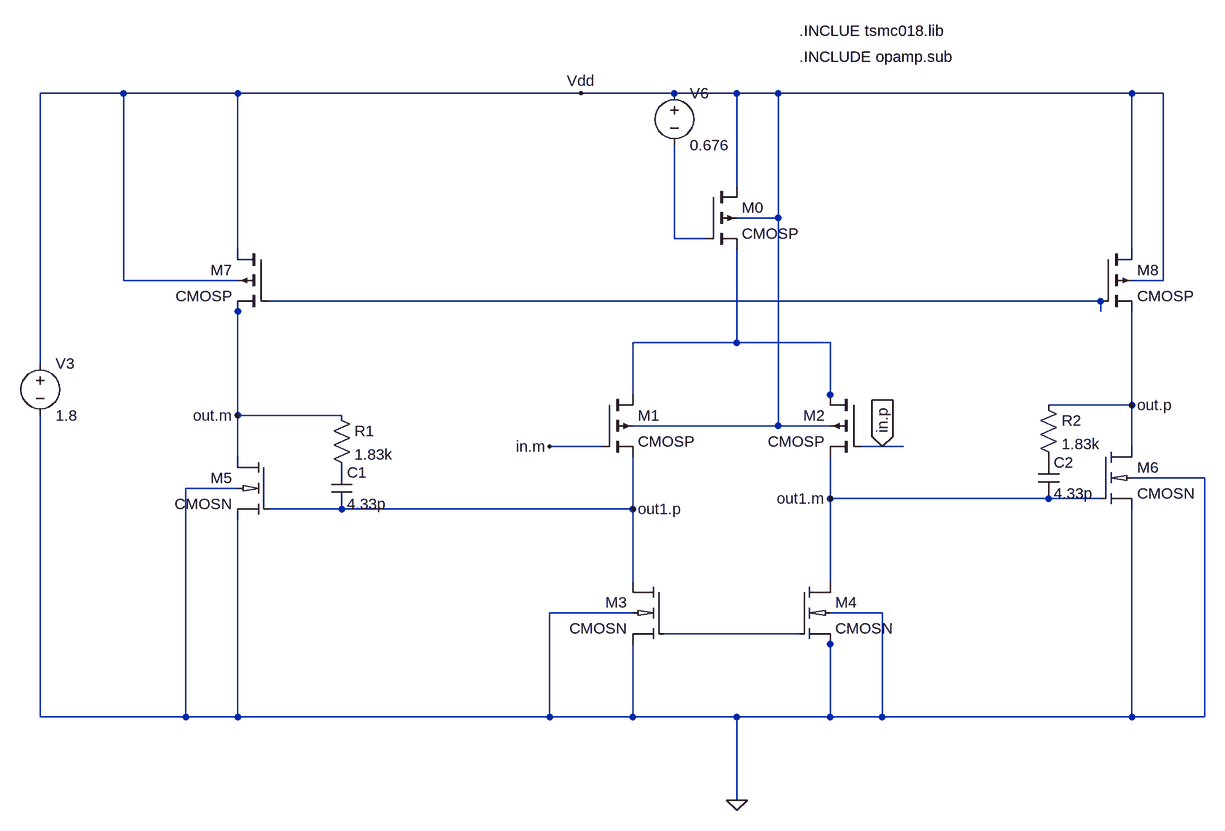
[diagram p0: schematic ideal_cmfb_opamp_fist.asc]
ideal_cmfb_opamp_fist.asc, the LTspice schematic file:
Version 4
SHEET 1 1796 680
WIRE 128 -480 0 -480
WIRE 304 -480 128 -480
WIRE 832 -480 304 -480
WIRE 976 -480 832 -480
WIRE 1072 -480 976 -480
WIRE 1136 -480 1072 -480
WIRE 1680 -480 1136 -480
WIRE 1728 -480 1680 -480
WIRE 1072 -336 1072 -480
WIRE 1136 -288 1136 -480
WIRE 1136 -288 1072 -288
WIRE 976 -256 976 -400
WIRE 1024 -256 976 -256
WIRE 304 -240 304 -480
WIRE 1680 -240 1680 -480
WIRE 128 -192 128 -480
WIRE 304 -192 128 -192
WIRE 1728 -192 1728 -480
WIRE 1728 -192 1680 -192
WIRE 1632 -160 352 -160
WIRE 304 -144 304 -160
WIRE 1632 -144 1632 -160
WIRE 1072 -96 1072 -240
WIRE 1072 -96 912 -96
WIRE 1216 -96 1072 -96
WIRE 0 -64 0 -480
WIRE 912 -16 912 -96
WIRE 1216 -16 1216 -96
WIRE 1216 0 1216 -16
WIRE 1680 0 1680 -144
WIRE 1680 0 1552 0
WIRE 304 16 304 -144
WIRE 464 16 304 16
WIRE 1136 32 1136 -288
WIRE 1136 32 912 32
WIRE 1216 32 1136 32
WIRE 864 64 784 64
WIRE 1296 64 1264 64
WIRE 1328 64 1296 64
WIRE 1680 64 1680 0
WIRE 304 80 304 16
WIRE 1792 112 1680 112
WIRE 304 128 224 128
WIRE 1216 144 1216 80
WIRE 1552 144 1216 144
WIRE 1632 144 1552 144
WIRE 464 160 352 160
WIRE 912 160 912 80
WIRE 912 160 464 160
WIRE 912 272 912 160
WIRE 1216 272 1216 144
WIRE 912 320 784 320
WIRE 1296 320 1216 320
WIRE 1168 352 960 352
WIRE 1216 368 1216 352
WIRE 0 480 0 16
WIRE 224 480 224 128
WIRE 224 480 0 480
WIRE 304 480 304 176
WIRE 304 480 224 480
WIRE 784 480 784 320
WIRE 784 480 304 480
WIRE 912 480 912 368
WIRE 912 480 784 480
WIRE 1072 480 912 480
WIRE 1216 480 1216 368
WIRE 1216 480 1072 480
WIRE 1296 480 1296 320
WIRE 1296 480 1216 480
WIRE 1680 480 1680 160
WIRE 1680 480 1296 480
WIRE 1792 480 1792 112
WIRE 1792 480 1680 480
WIRE 1072 608 1072 480
FLAG 1072 608 0
FLAG 1296 64 in.p
IOPIN 1296 64 In
FLAG 784 64 in.m
FLAG 304 16 out.m
FLAG 1680 0 out.p
FLAG 832 -480 Vdd
FLAG 1216 144 out1.m
FLAG 912 160 out1.p
SYMBOL cmosn 960 272 M0
SYMATTR InstName M3
SYMATTR Value2 l=0.18u w=0.8u ad=0.288P as=0.288P pd=2.32u ps=2.32u
SYMBOL cmosp 864 -16 R0
SYMATTR InstName M1
SYMATTR Value2 l=0.18u w=26u ad=0.936P as=0.936P pd=5.92u ps=5.92u
SYMBOL cmosp 1024 -336 R0
SYMATTR InstName M0
SYMATTR Value2 l=0.18u w=5.2u ad=1.872P as=1.872P pd=11.12u ps=11.12u
SYMBOL cmosp 1264 -16 M0
SYMATTR InstName M2
SYMATTR Value2 l=0.18u w=26u ad=0.936P as=0.936P pd=5.92u ps=5.92u
SYMBOL cmosn 1168 272 R0
SYMATTR InstName M4
SYMATTR Value2 l=0.18u w=0.8u ad=0.288P as=0.288P pd=2.32u ps=2.32u
SYMBOL cmosn 1632 64 R0
SYMATTR InstName M6
SYMATTR Value2 l=0.18u w=0.8u ad=0.288P as=0.288P pd=2.32u ps=2.32u
SYMBOL cmosn 352 80 M0
SYMATTR InstName M5
SYMATTR Value2 l=0.18u w=0.8u ad=0.288P as=0.288P pd=2.32u ps=2.32u
SYMBOL cmosp 1632 -240 R0
SYMATTR InstName M8
SYMATTR Value2 l=0.18u w=2.6u ad=0.936P as=0.936P pd=5.92u ps=5.92u
SYMBOL cmosp 352 -240 M0
SYMATTR InstName M7
SYMATTR Value2 l=0.18u w=2.6u ad=0.936P as=0.936P pd=5.92u ps=5.92u
SYMBOL cap 448 96 R0
SYMATTR InstName C1
SYMATTR Value 4.33p
SYMBOL res 448 0 R0
SYMATTR InstName R1
SYMATTR Value 1.83k
SYMBOL cap 1536 80 R0
SYMATTR InstName C2
SYMATTR Value 4.33p
SYMBOL res 1536 -16 R0
SYMATTR InstName R2
SYMATTR Value 1.83k
SYMBOL voltage 0 -80 R0
WINDOW 123 0 0 Left 0
WINDOW 39 0 0 Left 0
SYMATTR InstName V3
SYMATTR Value 1.8
SYMBOL voltage 976 -496 R0
WINDOW 123 0 0 Left 0
WINDOW 39 0 0 Left 0
SYMATTR InstName V6
SYMATTR Value 0.676
TEXT 1168 -576 Left 0 !.INCLUE tsmc018.lib
TEXT 1168 -536 Left 0 !.INCLUDE opamp.sub

The netlist it stands for:
* ideal_cmfb_opamp_fist.asc
M3 out1.p N004 0 0 CMOSN l=0.18u w=0.8u ad=0.288P as=0.288P pd=2.32u ps=2.32u
M1 N003 in.m out1.p Vdd CMOSP l=0.18u w=26u ad=0.936P as=0.936P pd=5.92u ps=5.92u
M0 Vdd N001 N003 Vdd CMOSP l=0.18u w=5.2u ad=1.872P as=1.872P pd=11.12u ps=11.12u
M2 N003 in.p out1.m Vdd CMOSP l=0.18u w=26u ad=0.936P as=0.936P pd=5.92u ps=5.92u
M4 out1.m N004 0 0 CMOSN l=0.18u w=0.8u ad=0.288P as=0.288P pd=2.32u ps=2.32u
M6 out.p out1.m 0 0 CMOSN l=0.18u w=0.8u ad=0.288P as=0.288P pd=2.32u ps=2.32u
M5 out.m out1.p 0 0 CMOSN l=0.18u w=0.8u ad=0.288P as=0.288P pd=2.32u ps=2.32u
M8 Vdd N002 out.p Vdd CMOSP l=0.18u w=2.6u ad=0.936P as=0.936P pd=5.92u ps=5.92u
M7 Vdd N002 out.m Vdd CMOSP l=0.18u w=2.6u ad=0.936P as=0.936P pd=5.92u ps=5.92u
C1 P001 out1.p 4.33p
R1 out.m P001 1.83k
C2 P002 out1.m 4.33p
R2 out.p P002 1.83k
V3 Vdd 0 1.8
V6 Vdd N001 0.676
.model NMOS NMOS
.model PMOS PMOS
.lib standard.mos
.INCLUE tsmc018.lib
.INCLUDE opamp.sub
.lib tsmc018.lib
.backanno
.end